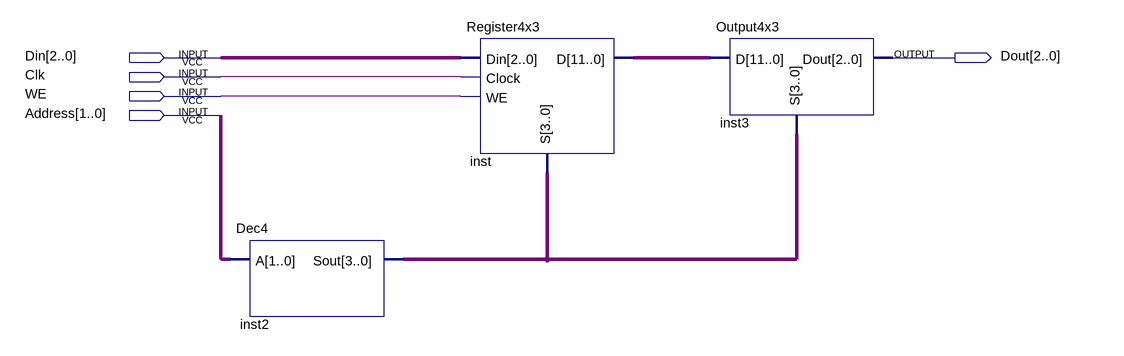
[diagram p0: schematic sheet]
// Quartus schematic L1001.bdf as structural Verilog: 3 symbols, 5 pins
module L1001 (
  input  [2:0] Din,
  input  Clk,
  input  WE,
  input  [1:0] Address,
  output [2:0] Dout
);

  wire [3:0] inst2_sout;
  wire [11:0] inst_d;

  Dec4 inst2 (.A(Address), .Sout(inst2_sout));
  Register4x3 inst (.Din(Din), .Clock(Clk), .WE(WE), .S(inst2_sout), .D(inst_d));
  Output4x3 inst3 (.D(inst_d), .S(inst2_sout), .Dout(Dout));
endmodule
